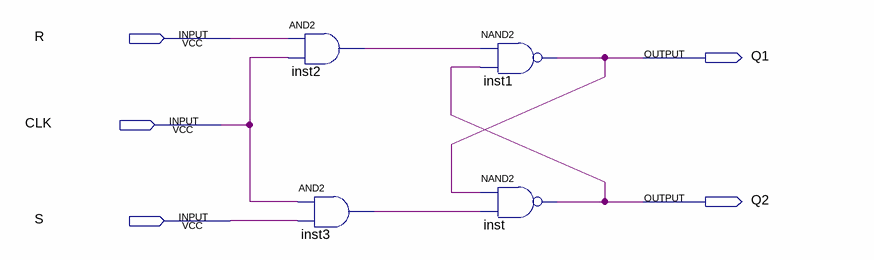
[diagram p0: schematic sheet]
// Quartus schematic flipflop_RS_nand.bdf as structural Verilog: 4 symbols, 5 pins
module flipflop_RS_nand (
  input  R,
  input  CLK,
  input  S,
  output Q1,
  output Q2
);

  wire inst2_out, inst3_out;

  and inst2 (inst2_out, R, CLK);
  and inst3 (inst3_out, CLK, S);
  nand inst1 (Q1, inst2_out, Q2);
  nand inst (Q2, Q1, inst3_out);
endmodule
